# EAGLE design sx1509-breakout (EAGLE 6.3)
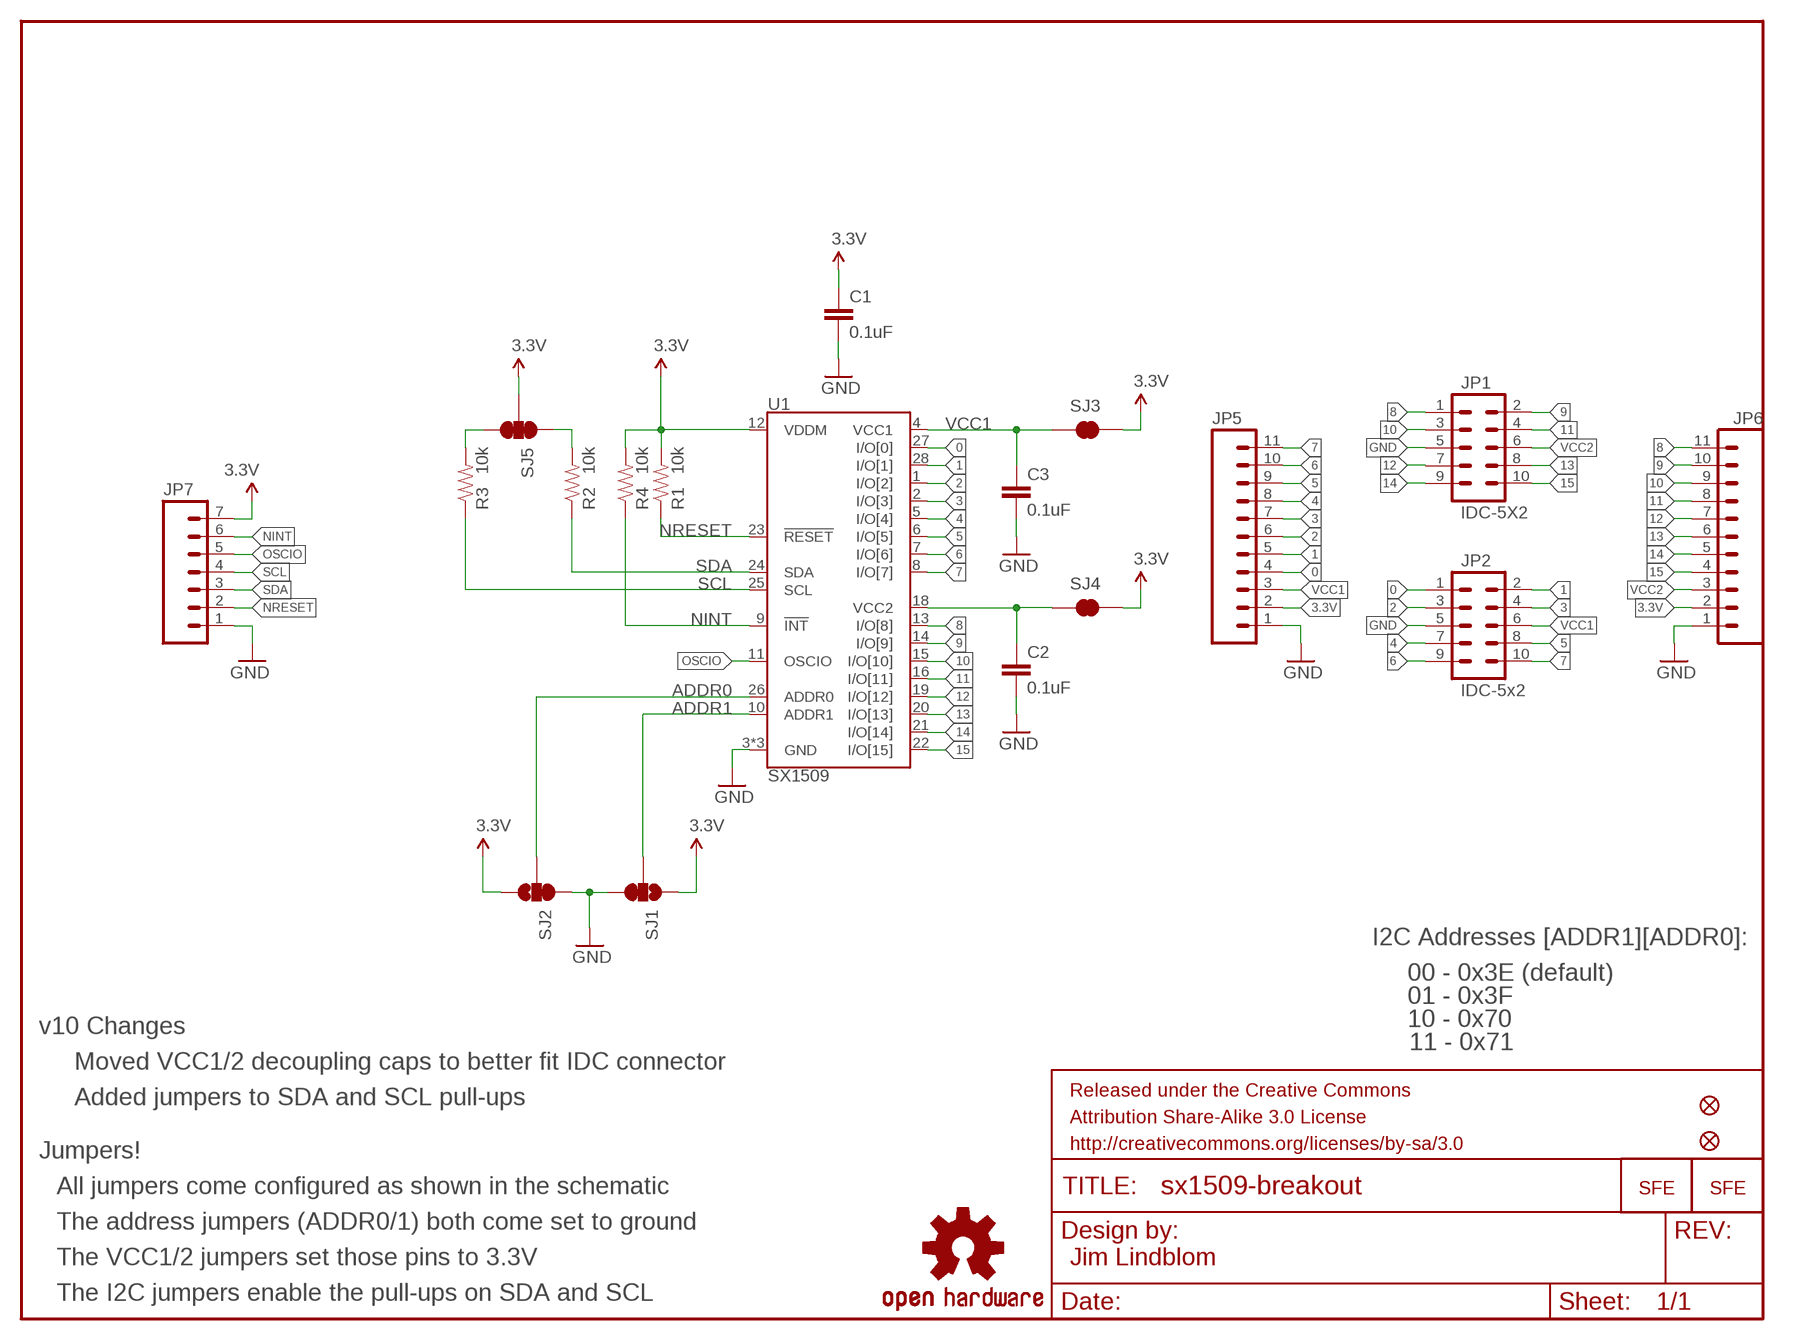
[diagram p0: schematic, sheet 1]

## Parts
C1  0.1uF  CAP0402-CAP  [0402-CAP]
C2  0.1uF  CAP0402-CAP  [0402-CAP]
C3  0.1uF  CAP0402-CAP  [0402-CAP]
JP1  IDC-5X2  M05X2SHD_NS  [2X5-SHROUDED-NO_SILK]
JP2  IDC-5x2  M05X2SHD_NS  [2X5-SHROUDED-NO_SILK]
JP3  LOGO-SFENEW  [SFE-NEW-WEBLOGO]
JP4  LOGO-SFESK  [SFE-LOGO-FLAME]
JP5  M111X11_NO_SILK  [1X11_NO_SILK]
JP6  M111X11_NO_SILK  [1X11_NO_SILK]
JP7  M07  [1X07]
JP8  FIDUCIALUFIDUCIAL  [MICRO-FIDUCIAL]
JP9  FIDUCIALUFIDUCIAL  [MICRO-FIDUCIAL]
R1  10k  RESISTOR0402-RES  [0402-RES]
R2  10k  RESISTOR0402-RES  [0402-RES]
R3  10k  RESISTOR0402-RES  [0402-RES]
R4  10k  RESISTOR0402-RES  [0402-RES]
SJ1  SOLDERJUMPER_2WAYS  [SJ_3]
SJ2  SOLDERJUMPER_2WAYS  [SJ_3]
SJ3  SOLDERJUMPERNO  [SJ_2S-NO]
SJ4  SOLDERJUMPERNO  [SJ_2S-NO]
SJ5  SOLDERJUMPER_2WAYS  [SJ_3]
U1  SX1509  [QFN-28]
U$1  OSHW-LOGOS  [OSHW-LOGO-S]

## Nets
0: JP2.1 JP5.4 U1.27(I/O[0])
1: JP2.2 JP5.5 U1.28(I/O[1])
2: JP2.3 JP5.6 U1.1(I/O[2])
3: JP2.4 JP5.7 U1.2(I/O[3])
3.3V: C1.1 JP5.2 JP6.2 JP7.7 R1.2 R4.2 SJ1.1 SJ2.3 SJ3.2 SJ4.2 SJ5.2 U1.12(VDDM)
4: JP2.7 JP5.8 U1.5(I/O[4])
5: JP2.8 JP5.9 U1.6(I/O[5])
6: JP2.9 JP5.10 U1.7(I/O[6])
7: JP2.10 JP5.11 U1.8(I/O[7])
8: JP1.1 JP6.11 U1.13(I/O[8])
9: JP1.2 JP6.10 U1.14(I/O[9])
10: JP1.3 JP6.9 U1.15(I/O[10])
11: JP1.4 JP6.8 U1.16(I/O[11])
12: JP1.7 JP6.7 U1.19(I/O[12])
13: JP1.8 JP6.6 U1.20(I/O[13])
14: JP1.9 JP6.5 U1.21(I/O[14])
15: JP1.10 JP6.4 U1.22(I/O[15])
ADDR0: SJ2.2 U1.26(ADDR0)
ADDR1: SJ1.2 U1.10(ADDR1)
GND: C1.2 C2.2 C3.2 JP1.5 JP2.5 JP5.1 JP6.1 JP7.1 SJ1.3 SJ2.1 U1.3(GND) U1.17(GND) U1.29(GND)
N$1: R3.2 SJ5.3
N$2: R2.2 SJ5.1
NINT: JP7.6 R4.1 U1.9(!INT)
NRESET: JP7.2 R1.1 U1.23(!RESET)
OSCIO: JP7.5 U1.11(OSCIO)
SCL: JP7.4 R3.1 U1.25(SCL)
SDA: JP7.3 R2.1 U1.24(SDA)
VCC1: C3.1 JP2.6 JP5.3 SJ3.1 U1.4(VCC1)
VCC2: C2.1 JP1.6 JP6.3 SJ4.1 U1.18(VCC2)

## Notes on the sheet
- I2C Addresses [ADDR1][ADDR0]:
- 00 - 0x3E (default)
- 01 - 0x3F
- v10 Changes | 10 - 0x70
- 11 - 0x71
- Moved VCC1/2 decoupling caps to better fit IDC connector
- Added jumpers to SDA and SCL pull-ups
- Jumpers!
- All jumpers come configured as shown in the schematic
- The address jumpers (ADDR0/1) both come set to ground
- The VCC1/2 jumpers set those pins to 3.3V | Jim Lindblom
- The I2C jumpers enable the pull-ups on SDA and SCL

## Library data of the parts
C1-C3 = SparkFun-Passives:CAP: Capacitor Standard 0603 ceramic capacitor, and 0.1" leaded capacitor.
JP1 JP2 = SparkFun-Connectors:M05X2: Header 5x2 Standard 10-pin dual row 0.1" header. Commonly used with AVR-ISP. Use with Spark Fun Electronics SKU: PRT-00778
JP3 JP4 = SparkFun-Aesthetics:LOGO-SFE: Spark Fun Electronics PCB Logo This is the standard Spark Fun Electronics PCB logo.
JP5 JP6 = SparkFun-Connectors:M11: Header 11 Standard 11-pin 0.1" header. Use with straight break away headers (SKU : PRT-00116), right angle break away headers (PRT-00553), swiss pins (PRT-00743), machine pins (PRT-00117), and female headers (PRT-00115).
JP7 = SparkFun-Connectors:M07: Header 7 Standard 7-pin 0.1" header. Use with straight break away headers (SKU : PRT-00116), right angle break away headers (PRT-00553), swiss pins (PRT-00743), machine pins (PRT-00117), and female headers (PRT-00115). NOTES ON THE VARIANTS LOCK and LOCK_LONGPADS... This footprint was designed to help hold the alignment of a through-hole component (i.e. 7-pin header) while soldering it into place. You may notice that each hole has been shifted either up or down by 0.005 of an inch from it's more standard position (which is usually a perfectly straight line). This slight alteration caused the pins (the squares in the middle) to touch the edges of the holes. Because they are alternating, it causes a "brace" to hold the header in place. 0.005 has proven to be the perfect amount of "off-center" position when using our standard breakaway headers. Although looks a little odd when you look at the bare footprint, once you have a header in there, the alteration is very hard to notice. Also, if you push a header all the way into place, it is covered up entirely on the bottom side. This idea of altering the position of holes to aid alignment will be further integrated into the Sparkfun Library for other footprints. It can help hold any component with 3 or more connection pins.
JP8 JP9 = SparkFun:FIDUCIAL: Fiducial Alignment Points Various fiducial points for machine vision alignment.
R1-R4 = SparkFun-Passives:RESISTOR: Resistor Basic schematic elements and footprints for 0603, 1206, and PTH resistors.
SJ1 SJ2 SJ5 = SparkFun-Passives:SOLDERJUMPER_2WAY: Solder Jumper 2 way solder jumper
SJ3 SJ4 = SparkFun-Passives:SOLDERJUMPER: Solder Jumper Standard SMD solder jumper. Used to automate production. Two varients : Normally Open and Normally Closed are the same, but have different paste layers. NC will have a large amount of paste and should jumper during reflow.
U1 = SparkFun-DigitalIC:SX1509
U$1 = SparkFun-Aesthetics:OSHW-LOGO: Open Source Hardware Logo This logo indicates the piece of hardware it is found on incorporates a OSHW license and/or adheres to the definition of open source hardware found here: http://freedomdefined.org/OSHW

## Board
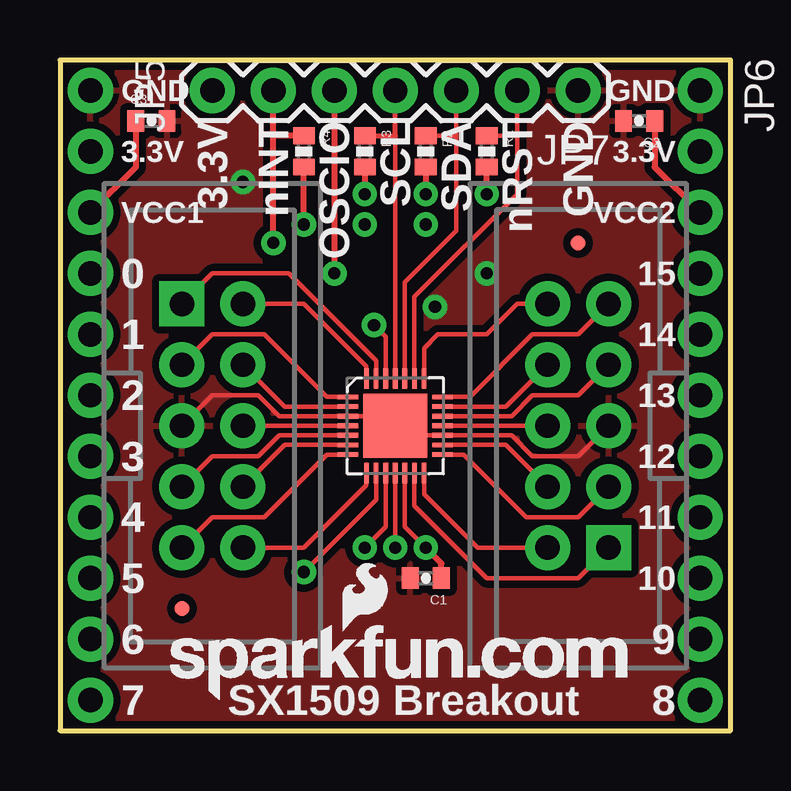
[diagram p1: board, top side]
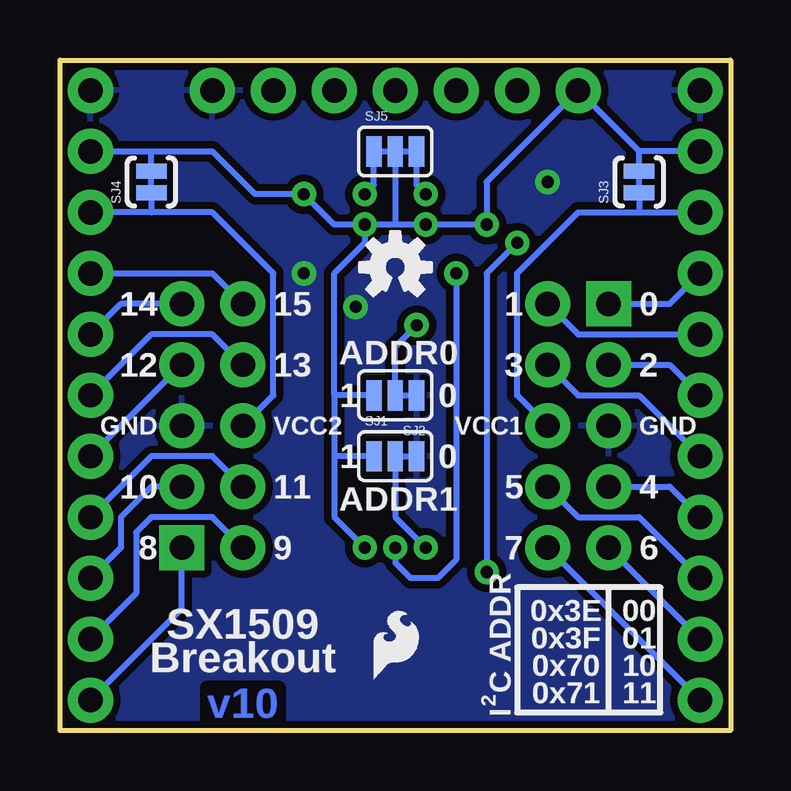
[diagram p2: board, bottom side, seen from below]

Size 27.94 x 27.94 mm. Coordinates in mm from the lower left corner, seen from the top.
Outline: 0,27.94 0,0 27.94,0 27.94,27.94 0,27.94
Copper layers (1*16): Top 0.035mm / dielectric 1.5mm / Bottom 0.035mm
Design rules: minimum track width 7mil, minimum drill 20mil, track to track 7mil, track to pad 8mil, pad to pad 8mil, via to via 8mil, smd to smd 8mil, copper to edge 8mil, drill to drill 8mil, minimum pad ring 12mil, minimum via ring 10mil, stop-mask expansion 4mil, vias tented up to drill 20mil, thermal gap 10mil

### Footprints (pad centres in the part's own frame; a part is rotated, then mirrored left to right if it is on the bottom)
0402-CAP = smd 0.7 x 0.9: 1 -0.65,0; 2 0.65,0
2X5-SHROUDED-NO_SILK = drill 1.016 pad 1.88 square: 1 -1.27,5.08 | drill 1.016 pad 1.88: 2 1.27,5.08; 3 -1.27,2.54; 4 1.27,2.54; 5 -1.27,0; 6 1.27,0; 7 -1.27,-2.54; 8 1.27,-2.54; 9 -1.27,-5.08; 10 1.27,-5.08
1X11_NO_SILK = drill 1.016 pad 1.88: 1 0,0; 2 2.54,0; 3 5.08,0; 4 7.62,0; 5 10.16,0; 6 12.7,0; 7 15.24,0; 8 17.78,0; 9 20.32,0; 10 22.86,0; 11 25.4,0
1X07 = drill 1.016 pad 1.88: 1 0,0; 2 2.54,0; 3 5.08,0; 4 7.62,0; 5 10.16,0; 6 12.7,0; 7 15.24,0
MICRO-FIDUCIAL = smd 0.635 x 0.635: 1 0,0
0402-RES = smd 0.7 x 0.9: 1 -0.65,0; 2 0.65,0
SJ_3 = smd 0.635 x 1.27: 1 -0.889,0; 2 0,0; 3 0.889,0
SJ_2S-NO = smd 0.635 x 1.27: 1 -0.45,0; 2 0.45,0
QFN-28 = smd 0.85 x 0.2: 1 -1.975,1.2; 2 -1.975,0.8; 3 -1.975,0.4; 4 -1.975,0; 5 -1.975,-0.4; 6 -1.975,-0.8; 7 -1.975,-1.2; 15 1.975,-1.2; 16 1.975,-0.8; 17 1.975,-0.4; 18 1.975,0; 19 1.975,0.4; 20 1.975,0.8; 21 1.975,1.2 | smd 0.2 x 0.85: 8 -1.2,-1.975; 9 -0.8,-1.975; 10 -0.4,-1.975; 11 0,-1.975; 12 0.4,-1.975; 13 0.8,-1.975; 14 1.2,-1.975; 22 1.2,1.975; 23 0.8,1.975; 24 0.4,1.975; 25 0,1.975; 26 -0.4,1.975; 27 -0.8,1.975; 28 -1.2,1.975 | smd 2.65 x 2.65: 29 0,0

### Placement (x,y rotation side)
C1  15.24,6.35 180 top
C2  24.13,25.4 180 top
C3  3.81,25.4 0 top
JP1  21.59,12.7 180 top
JP2  6.35,12.7 0 top
JP3  4.57,1.27 0 top
JP4  14.86,2.16 0 bottom
JP5  1.27,26.67 270 top
JP6  26.67,26.67 270 top
JP7  21.59,26.67 180 top
JP8  21.59,20.32 0 top
JP9  5.08,5.08 0 top
R1  17.78,24.13 270 top
R2  15.24,24.13 270 top
R3  12.7,24.13 270 top
R4  10.16,24.13 270 top
SJ1  13.97,11.43 0 bottom
SJ2  13.97,13.97 180 bottom
SJ3  3.81,22.86 90 bottom
SJ4  24.13,22.86 90 bottom
SJ5  13.97,24.13 0 bottom
U1  13.97,12.7 0 top
U$1  13.97,19.3 0 bottom

### Tracks (layer width: path | path; a pad name or v marks a point on that pad's centre or on a via)
0
  Top 0.178: U1.27 13.17,15.4 9.53,19.05 6.35,19.05 JP2.1
  Bottom 0.254: JP2.1 2.54,17.78 JP5.4
1
  Top 0.178: U1.28 12.77,15.17 10.16,17.78 JP2.2
  Bottom 0.254: JP2.2 6.35,16.51 JP5.5
2
  Top 0.178: U1.1 11.12,13.9 8.51,16.51 6.35,16.51 JP2.3
  Bottom 0.254: JP2.3 2.54,15.24 JP5.6
3
  Top 0.178: U1.2 9.36,13.5 JP2.4
  Bottom 0.254: JP2.4 6.35,13.97 3.81,13.97 JP5.7
3.3V  (via drill 0.51)
  Top 0.178: U1.12 14.37,8.49 v15.24,7.62
  Top 0.254: v10.16,21.08 R4.2 | v17.78,22.35 R1.2 | C1.1 15.89,6.97 v15.24,7.62
  Bottom 0.254: 13.97,21.08 v12.7,21.08 v10.16,21.08 10.16,22.86 JP7.7 3.81,24.13 | 13.97,21.08 v15.24,21.08 | v15.24,21.08 15.24,20.32 16.51,19.05 16.51,13.97 | 16.51,13.97 16.51,11.43 | 16.51,11.43 16.51,8.89 v15.24,7.62 | SJ1.1 16.51,11.43 | SJ2.3 16.51,13.97 | JP5.2 3.81,24.13 | SJ3.2 3.81,24.13 | JP6.2 24.13,24.13 | 24.13,24.13 21.59,24.13 19.81,22.35 v17.78,22.35 16.51,21.08 v15.24,21.08 | SJ4.2 24.13,24.13 | SJ5.2 13.97,21.08
4
  Top 0.178: U1.5 9.12,12.3 8.26,11.43 6.35,11.43 JP2.7
  Bottom 0.254: JP2.7 2.54,10.16 JP5.8
5
  Top 0.178: U1.6 9.36,11.9 JP2.8
  Bottom 0.254: JP2.8 6.35,8.89 3.81,8.89 JP5.9
6
  Top 0.178: U1.7 11.12,11.5 8.51,8.89 6.35,8.89 JP2.9
  Bottom 0.254: JP2.9 JP5.10
7
  Top 0.178: U1.8 12.77,10.23 10.16,7.62 JP2.10
  Bottom 0.254: JP2.10 JP5.11
8
  Top 0.178: U1.13 14.77,9.36 17.78,6.35 21.59,6.35 JP1.1
  Bottom 0.254: JP6.11 22.86,5.08 JP1.1
9
  Top 0.178: U1.14 15.17,9.85 17.4,7.62 JP1.2
  Bottom 0.254: JP1.2 21.59,8.89 24.13,8.89 24.77,8.26 24.77,5.71 JP6.10
10
  Top 0.178: U1.15 16.82,11.5 19.43,8.89 21.59,8.89 JP1.3
  Bottom 0.254: JP1.3 24.13,10.16 25.4,8.89 25.4,7.62 JP6.9
11
  Top 0.178: U1.16 18.58,11.9 JP1.4
  Bottom 0.254: JP1.4 21.59,11.43 24.13,11.43 JP6.8
12
  Top 0.178: U1.19 18.82,13.1 19.68,13.97 21.59,13.97 JP1.7
  Bottom 0.254: JP1.7 JP6.7
13
  Top 0.178: U1.20 18.58,13.5 JP1.8
  Bottom 0.254: JP1.8 21.59,16.51 24.13,16.51 JP6.6
14
  Top 0.178: JP1.9 21.59,16.51 19.68,16.51 17.09,13.91 15.95,13.91
  Top 0.196: U1.21 15.95,13.91
  Bottom 0.254: JP1.9 25.4,17.78 JP6.5
15
  Top 0.178: U1.22 15.17,15.93 15.75,16.51 17.78,16.51 19.05,17.78 JP1.10
  Bottom 0.254: JP6.4 21.59,19.05 JP1.10
ADDR0  (via drill 0.51)
  Top 0.178: U1.26 13.57,16.4 v13.08,16.89
  Bottom 0.254: SJ2.2 13.97,16 v13.08,16.89
ADDR1  (via drill 0.51)
  Top 0.178: U1.10 13.57,8.49 v12.7,7.62
  Bottom 0.254: SJ1.2 13.97,8.89 v12.7,7.62
GND  (via drill 0.51)
  Top 0.178: U1.17 18.82,12.3 19.68,11.43 21.59,11.43 | U1.3 9.12,13.1 8.26,13.97 6.35,13.97
  Top 0.196: U1.17 14.37,12.3 U1.29 13.57,13.1 U1.3 | 21.59,11.43 JP1.5 | JP2.5 6.35,13.97
  other vias: 17.78,19.05 7.62,22.86 15.62,17.65
  pour Top (isolate 0.305): 0,27.94 0,0 27.94,0 27.94,27.94
  pour Bottom (isolate 0.305): 0,27.94 0,0 27.94,0 27.94,27.94
N$1  (via drill 0.51)
  Top 0.254: R3.2 v12.7,22.35
  Bottom 0.254: v12.7,22.35 13.08,22.73 SJ5.3
N$2  (via drill 0.51)
  Top 0.254: R2.2 v15.24,22.35
  Bottom 0.254: v15.24,22.35 14.86,22.73 SJ5.1
N$3
  Bottom 0.254: 13.97,13.97 13.08,13.97
N$4
  Bottom 0.254: 13.97,11.43 13.08,11.43
N$5
  Bottom 0.254: 14.61,24.13 13.34,24.13
N$6
  Bottom 0.254: 24.13,22.48 24.13,23.24
N$7
  Bottom 0.254: 3.81,22.48 3.81,23.11
NINT  (via drill 0.51)
  Top 0.178: U1.9 13.17,9.61 v10.16,6.6
  Top 0.254: v8.89,20.32 8.89,24.77 | 8.89,24.77 JP7.6 | R4.1 8.9,24.78 8.89,24.77
  Bottom 0.254: v8.89,20.32 10.16,19.05 v10.16,6.6
NRESET
  Top 0.178: U1.23 14.77,18.07 19.05,22.35 19.05,24.89
  Top 0.196: JP7.2 19.05,24.89 18.94,24.78 R1.1
OSCIO  (via drill 0.51)
  Top 0.178: U1.11 v13.97,7.62
  Top 0.254: JP7.5 v11.43,19.05
  Bottom 0.254: v11.43,19.05 11.43,7.11 12.19,6.35 13.34,6.35 13.97,6.99 v13.97,7.62
SCL
  Top 0.178: U1.25 13.97,24.77
  Top 0.196: 13.96,24.78 13.97,24.77
  Top 0.2: 13.97,24.77 JP7.4 | R3.1 13.96,24.78
SDA
  Top 0.178: U1.24 14.37,18.69 16.51,20.83 16.51,24.89
  Top 0.196: JP7.3 16.51,24.89 16.4,24.78 R2.1
VCC1
  Top 0.178: U1.4 JP2.6
  Top 0.254: C3.1 3.16,23.48 JP5.3
  Bottom 0.254: JP2.6 8.89,13.97 8.89,19.05 6.35,21.59 3.81,21.59 | 3.81,21.59 JP5.3 | SJ3.1 3.81,21.59
VCC2
  Top 0.178: U1.18 JP1.6
  Top 0.254: C2.1 24.78,23.48 JP6.3
  Bottom 0.254: JP1.6 19.05,13.97 19.05,19.05 21.59,21.59 24.13,21.59 | 24.13,21.59 JP6.3 | SJ4.1 24.13,21.59

### Text on the board
Bottom: v10
tPlace: GND | GND | 3.3V | nINT | OSCIO | SCL | SDA | nRST | GND | 3.3V | 3.3V | VCC1 | VCC2 | 0 | 15 | 1 | 14 | 2 | 13 | 3 | 12 | 4 | 11 | 5 | 10 | 6 | 9 | 7 | SX1509 Breakout | 8
bPlace: 0 | 1 | 15 | 14 | ADDR0 | 2 | 3 | 13 | 12 | 0 | 1 | GND | VCC1 | VCC2 | GND | 0 | 1 | 4 | 5 | ADDR1 | 11 | 10 | 6 | 7 | 9 | 8 | 00 | 0x3E | 01 | 0x3F | C ADDR | SX1509 | 10 | 0x70 | 11 | 0x71 | Breakout | I | 2